# EAGLE design main_board (EAGLE 9.6.2)
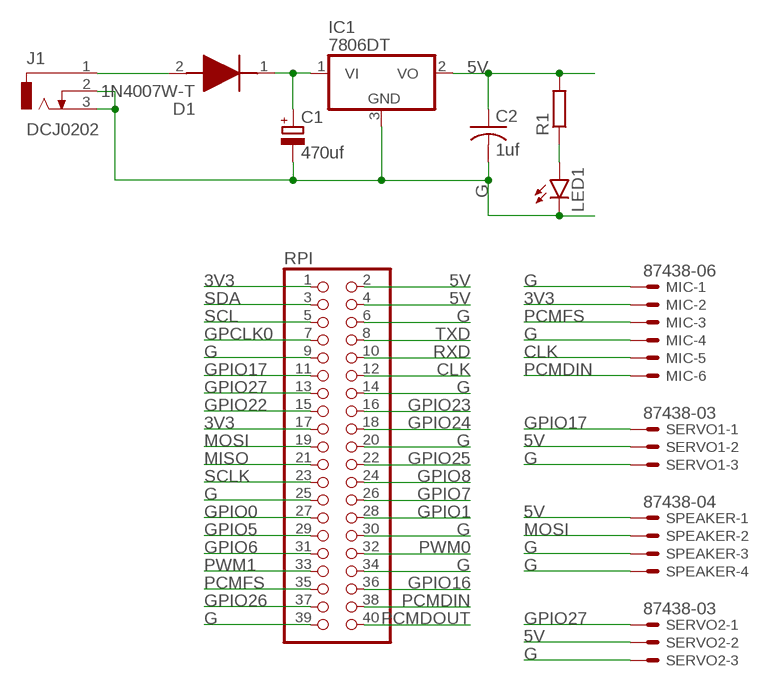
[diagram p0: schematic, sheet 1]

## Parts
C1  470uf  CPOL-EUD  [PANASONIC_D]
C2  1uf  C-USC0805  [C0805]
D1  1N4007W-T  [SODFL3818X130N]
IC1  7806DT  [TO252]
J1  DCJ0202  [DCJ0202]
LED1  LEDCHIP-LED0805  [CHIP-LED0805]
MIC  87438-06  [87438-06]
R1  R-EU_R0603  [R0603]
RPI  PINHD-2X20  [2X20]
SERVO1  87438-03  [87438-03]
SERVO2  87438-03  [87438-03]
SPEAKER  87438-04  [87438-04]

## Nets
3V3: MIC.2 RPI.1 RPI.17
5V: C2.1 IC1.2(VO) R1.2 RPI.2 RPI.4 SERVO1.2 SERVO2.2 SPEAKER.1
CLK: MIC.5 RPI.12
G: C1.- C2.2 IC1.3(GND) J1.2 J1.3 LED1.C MIC.1 MIC.4 RPI.6 RPI.9 RPI.14 RPI.20 RPI.25 RPI.30 RPI.34 RPI.39 SERVO1.3 SERVO2.3 SPEAKER.3 SPEAKER.4
GPCLK0: RPI.7
GPIO0: RPI.27
GPIO1: RPI.28
GPIO5: RPI.29
GPIO6: RPI.31
GPIO7: RPI.26
GPIO8: RPI.24
GPIO16: RPI.36
GPIO17: RPI.11 SERVO1.1
GPIO22: RPI.15
GPIO23: RPI.16
GPIO24: RPI.18
GPIO25: RPI.22
GPIO26: RPI.37
GPIO27: RPI.13 SERVO2.1
MISO: RPI.21
MOSI: RPI.19 SPEAKER.2
N$1: C1.+ D1.1(K) IC1.1(VI)
N$3: LED1.A R1.1
N$4: D1.2(A) J1.1
PCMDIN: MIC.6 RPI.38
PCMDOUT: RPI.40
PCMFS: MIC.3 RPI.35
PWM0: RPI.32
PWM1: RPI.33
RXD: RPI.10
SCL: RPI.5
SCLK: RPI.23
SDA: RPI.3
TXD: RPI.8

## Library data of the parts
C1 = rcl:CPOL-EU: POLARIZED CAPACITOR, European symbol; SPICEPREFIX: C
C2 = rcl:C-US: CAPACITOR, American symbol; SPICEPREFIX: C
D1 = 1N4007W-T:1N4007W-T: Rectifiers SOD-123,1A,1000V,GP Source: Datasheet <https://www.mouser.cn/datasheet/2/345/1n4001w_1n4007w-2449105.pdf>; ARROW_PART_NUMBER: 1N4007W-T; ARROW_PRICE-STOCK: null?region=nac; DESCRIPTION: Rectifiers SOD-123,1A,1000V,GP; HEIGHT: 1.3mm; MANUFACTURER_NAME: Rectron; MANUFACTURER_PART_NUMBER: 1N4007W-T; MOUSER_PART_NUMBER: 583-1N4007W-T; MOUSER_PRICE-STOCK: https://www.mouser.co.uk/ProductDetail/Rectron/1N4007W-T?qs=QNEnbhJQKvah3J4JbJr%2FPw%3D%3D
IC1 = linear:78*: Positive VOLTAGE REGULATOR Source: http://cache.national.com/ds/LM/LM78L05.pdf http://www.fairchildsemi.com/ds/LM/LM7805.pdf
J1 = con-jack:DCJ0202: DC POWER JACK Source: DCJ0202.pdf; OC_FARNELL: unknown; OC_NEWARK: unknown
LED1 = led:LED: LED OSRAM: - CHIPLED LG R971, LG N971, LY N971, LG Q971, LY Q971, LO R971, LY R971 LH N974, LH R974 LS Q976, LO Q976, LY Q976 LO Q996 - Hyper CHIPLED LW Q18S LB Q993, LB Q99A, LB R99A - SideLED LS A670, LO A670, LY A670, LG A670, LP A670 LB A673, LV A673, LT A673, LW A673 LH A674 LY A675 LS A676, LA A676, LO A676, LY A676, LW A676 LS A679, LY A679, LG A679 - Hyper Micro SIDELED® LS Y876, LA Y876, LO Y876, LY Y876 LT Y87S - SmartLED LW L88C, LW L88S LB L89C, LB L89S, LG L890 LS L89K, LO L89K, LY L89K LS L896, LA L896, LO L896, LY L896 - TOPLED LS T670, LO T670, LY T670, LG T670, LP T670 LSG T670, LSP T670, LSY T670, LOP T670, LYG T670 LG T671, LOG T671, LSG T671 LB T673, LV T673, LT T673, LW T673 LH T674 LS T676, LA T676, LO T676, LY T676, LB T676, LH T676, LSB T676, LW T676 LB T67C, LV T67C, LT T67C, LS T67K, LO T67K, LY T67K, LW E67C LS E67B, LA E67B, LO E67B, LY E67B, LB E67C, LV E67C, LT E67C LW T67C LS T679, LY T679, LG T679 LS T770, LO T770, LY T770, LG T770, LP T770 LB T773, LV T773, LT T773, LW T773 LH T774 LS E675, LA E675, LY E675, LS T675 LS T776, LA T776, LO T776, LY T776, LB T776 LHGB T686 LT T68C, LB T68C - Hyper Mini TOPLED® LB M676 - Mini TOPLED Santana® LG M470 LS M47K, LO M47K, LY M47K Source: http://www.osram.convergy.de LUXEON: - LUMILED® LXK2-PW12-R00, LXK2-PW12-S00, LXK2-PW14-U00, LXK2-PW14-V00 LXK2-PM12-R00, LXK2-PM12-S00, LXK2-PM14-U00 LXK2-PE12-Q00, LXK2-PE12-R00, LXK2-PE12-S00, LXK2-PE14-T00, LXK2-PE14-U00 LXK2-PB12-K00, LXK2-PB12-L00, LXK2-PB12-M00, LXK2-PB14-N00, LXK2-PB14-P00, LXK2-PB14-Q00 LXK2-PR12-L00, LXK2-PR12-M00, LXK2-PR14-Q00, LXK2-PR14-R00 LXK2-PD12-Q00, LXK2-PD12-R00, LXK2-PD12-S00 LXK2-PH12-R00, LXK2-PH12-S00 LXK2-PL12-P00, LXK2-PL12-Q00, LXK2-PL12-R00 Source: www.luxeon.com KINGBRIGHT: KA-3528ASYC Source: www.kingbright.com
MIC = con-molex:87438-06: Wire-to-Board 1.50mm (.059") Pitch Header - Right Angle, SMT, Shrouded Source: http://www.molex.com/product/micro/87438.html; MF: MOLEX; MPN: 87438-0643; OC_FARNELL: 1756938; OC_NEWARK: 88K3155
R1 = rcl:R-EU_: RESISTOR, European symbol; SPICEPREFIX: R
RPI = pinhead:PINHD-2X20: PIN HEADER
SERVO1 SERVO2 = con-molex:87438-03: Wire-to-Board 1.50mm (.059") Pitch Header - Right Angle, SMT, Shrouded Source: http://www.molex.com/product/micro/87438.html; MF: MOLEX; OC_FARNELL: 1711328; OC_NEWARK: unknown
SPEAKER = con-molex:87438-04: Wire-to-Board 1.50mm (.059") Pitch Header - Right Angle, SMT, Shrouded Source: http://www.molex.com/product/micro/87438.html; MF: MOLEX; OC_FARNELL: unknown; OC_NEWARK: unknown

## Board
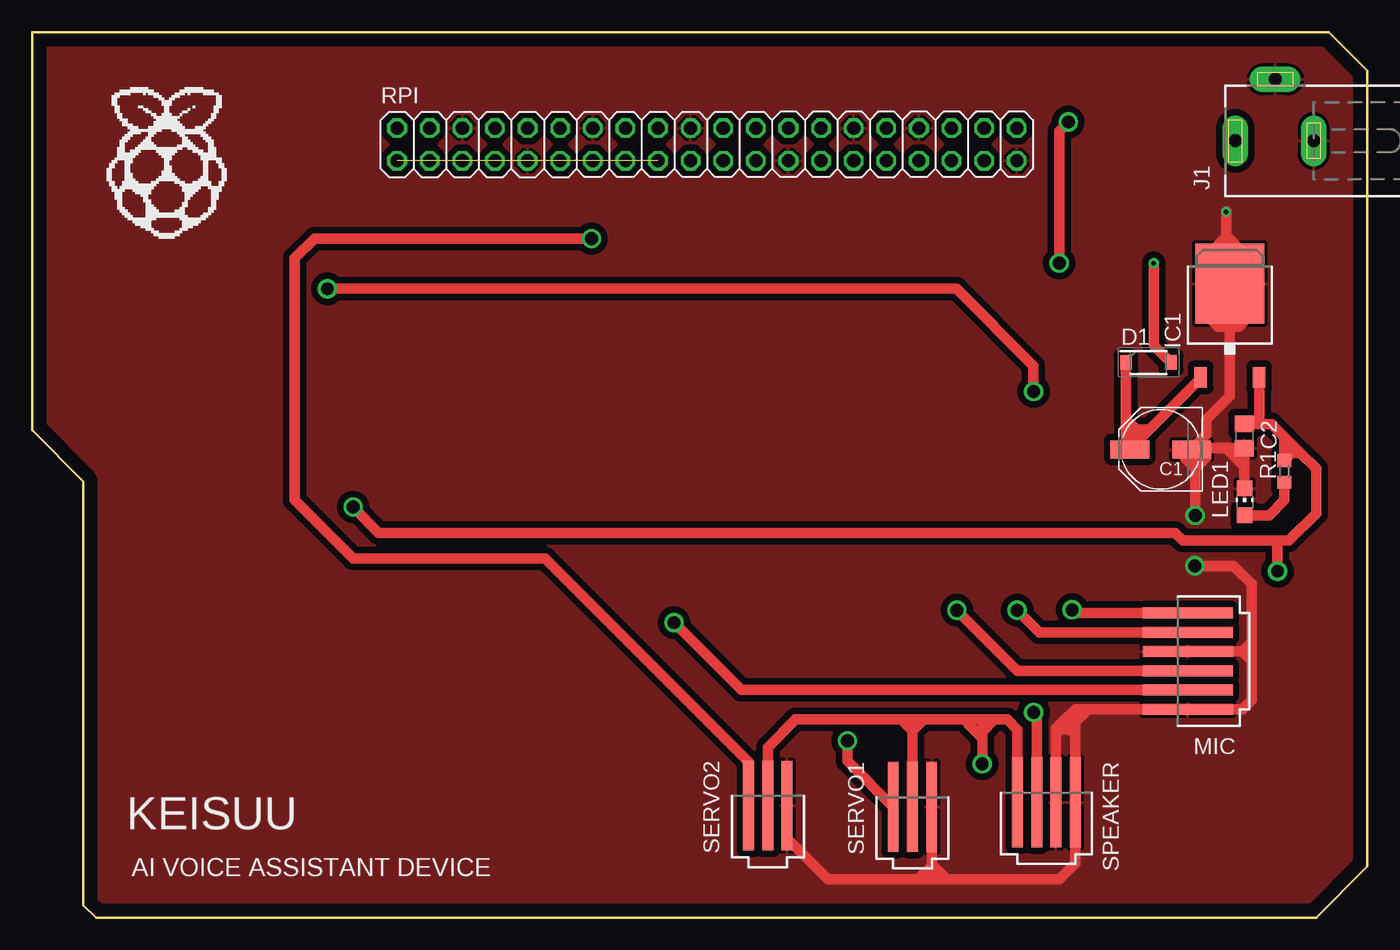
[diagram p1: board, top side]
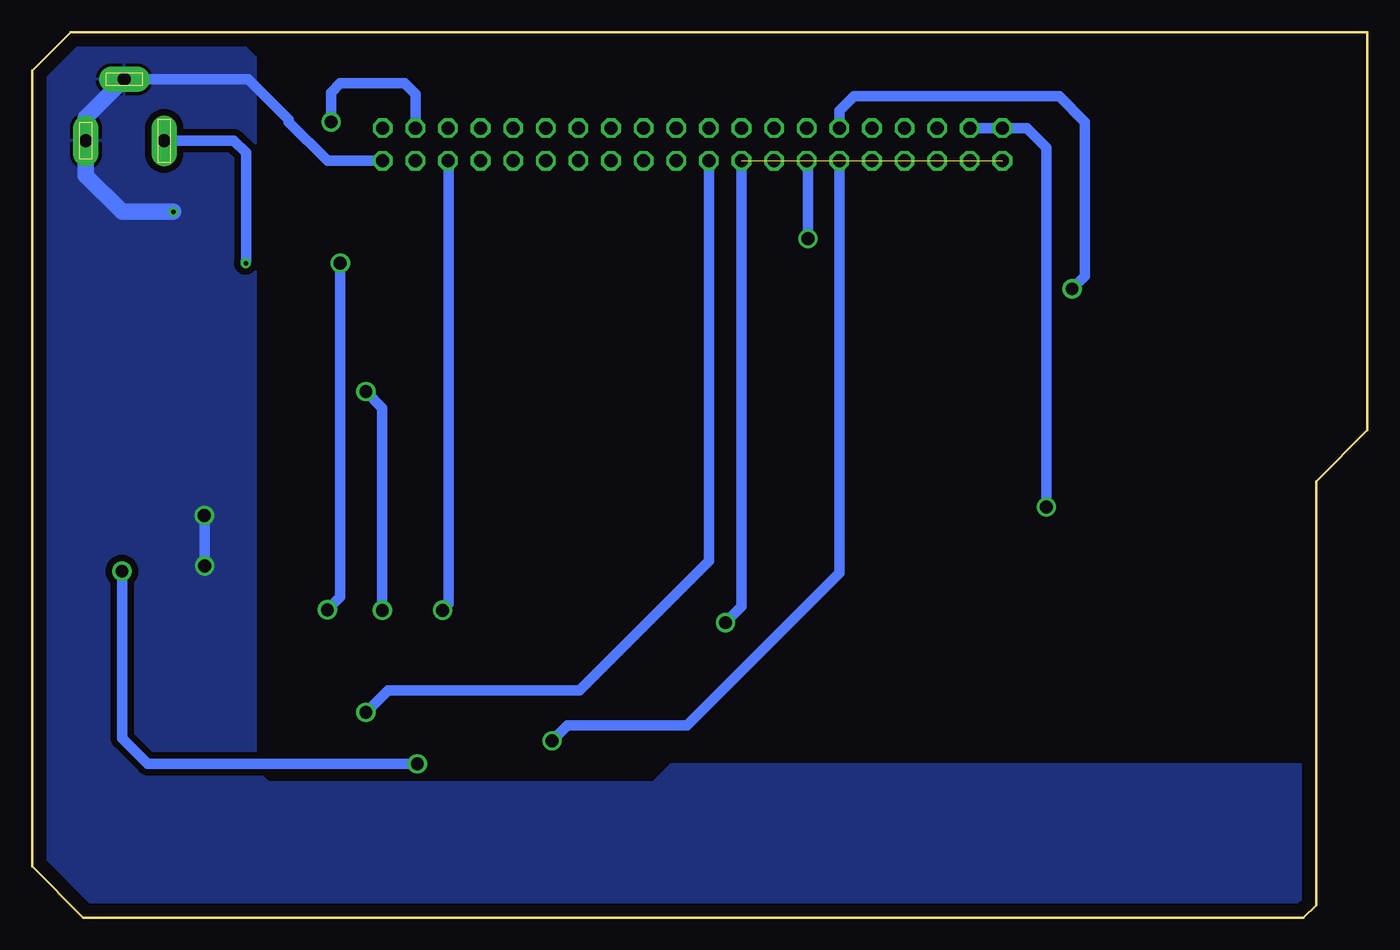
[diagram p2: board, bottom side, seen from below]

Size 104 x 69 mm. Coordinates in mm from the lower left corner, seen from the top.
Outline: 0,69 101,69 104,66 104,4 100,0 5,0 4,1 4,34 0,38 0,69
Copper layers (1*16): Top 0.035mm / dielectric 1.5mm / Bottom 0.035mm
Design rules "default *": minimum track width 6mil, minimum drill 0.35mm, track to track 6mil, track to pad 6mil, pad to pad 6mil, via to via 2.5mm, smd to smd 6mil, copper to edge 40mil, drill to drill 6mil, minimum pad ring 10mil, minimum via ring 8mil, stop-mask expansion 4mil, vias tented up to drill 0mil, thermal gap 10mil

### Footprints (pad centres in the part's own frame; a part is rotated, then mirrored left to right if it is on the bottom)
PANASONIC_D = smd 3 x 1.4: + 2.4,0; - -2.4,0
C0805 = smd 1.3 x 1.5: 1 -0.95,0; 2 0.95,0
SODFL3818X130N = smd 0.92 x 1.13: 1 -1.75,0; 2 1.75,0
TO252 = smd 1 x 1.6: 1 -2.28,-4.8; 2 2.28,-4.8 | smd 5.4 x 6.2: 3 0,2.5
DCJ0202 = drill 1 pad 2 long: 1 0,3.1; 2 4.8,0; 3 0,-3
CHIP-LED0805 = smd 1.2 x 1.2: A 0,-1.05; C 0,1.05
87438-06 = smd 7 x 0.85: 1 0,3.75; 2 0,2.25; 3 0,0.75; 4 0,-0.75; 5 0,-2.25; 6 0,-3.75
R0603 = smd 1 x 1.1: 1 -0.85,0; 2 0.85,0
2X20 = drill 1.016 octagon: 1 -24.13,-1.27; 2 -24.13,1.27; 3 -21.59,-1.27; 4 -21.59,1.27; 5 -19.05,-1.27; 6 -19.05,1.27; 7 -16.51,-1.27; 8 -16.51,1.27; 9 -13.97,-1.27; 10 -13.97,1.27; 11 -11.43,-1.27; 12 -11.43,1.27; 13 -8.89,-1.27; 14 -8.89,1.27; 15 -6.35,-1.27; 16 -6.35,1.27; 17 -3.81,-1.27; 18 -3.81,1.27; 19 -1.27,-1.27; 20 -1.27,1.27; 21 1.27,-1.27; 22 1.27,1.27; 23 3.81,-1.27; 24 3.81,1.27; 25 6.35,-1.27; 26 6.35,1.27; 27 8.89,-1.27; 28 8.89,1.27; 29 11.43,-1.27; 30 11.43,1.27; 31 13.97,-1.27; 32 13.97,1.27; 33 16.51,-1.27; 34 16.51,1.27; 35 19.05,-1.27; 36 19.05,1.27; 37 21.59,-1.27; 38 21.59,1.27; 39 24.13,-1.27; 40 24.13,1.27
87438-03 = smd 7 x 0.85: 1 0,1.5; 2 0,0; 3 0,-1.5
87438-04 = smd 7 x 0.85: 1 0,2.25; 2 0,0.75; 3 0,-0.75; 4 0,-2.25

### Placement (x,y rotation side)
C1  87.9,36.5 180 top
C2  94.42,37.53 270 top
D1  86.95,43.26 0 top
IC1  93.28,46.91 0 top
J1  96.82,60.53 90 top
LED1  94.44,32.41 0 top
MIC  90,20 180 top
R1  97.54,34.79 90 top
RPI  52.56,60.25 0 top
SERVO1  68.56,8.66 90 top
SERVO2  57.3,8.75 90 top
SPEAKER  79,9 90 top

### Tracks (layer width: path | path; a pad name or v marks a point on that pad's centre or on a via)
3V3  (via drill 1)  (1 unrouted)
  Top 0.813: MIC.2 55.25,17.75 v50,23
  Bottom 0.813: v50,23 48.75,24.25 RPI.17
5V  (via drill 1)
  Top 0.813: 94.56,38.63 C2.1 95.79,38.48 | IC1.2 95.56,38.71 95.79,38.48 | 97.54,37.46 R1.2 98.13,36.23 98.77,36.23 | 95.79,38.48 96.52,38.48 97.54,37.46 | 98.77,36.23 100,35 100,31.5 97.88,29.38 97,29.38 | 98.77,36.23 97.54,37.46 | v25,32 27,30 89,30 89.62,29.38 97,29.38 | SPEAKER.1 76.75,14.66 75.96,15.45 74.95,15.45 | 69.45,15.45 72.91,15.45 | 72.91,15.45 74,15.45 | 74,15.45 74.95,15.45 | SERVO1.2 68.56,14.56 | 68.56,14.56 69.45,15.45 | SERVO2.2 57.3,13.3 59.45,15.45 67.96,15.45 | 67.96,15.45 69.45,15.45 | 67.96,15.45 67.96,15.17 68.56,14.56 | 74,15.45 74,14.51 | 74,14 v74,12 | v97,27 97,29.38 | 74,14.51 74,14 | 74,14.51 74.95,15.45 | 74,14 72.91,15.09 72.91,15.45
  Bottom 0.813: RPI.4 RPI.2 26.52,61.52 25,60 v25,32 | v74,12 95,12 97,14 v97,27
CLK  (via drill 1)
  Top 0.813: v78,41 78,43 72,49 v23,49 | MIC.5 78.43,22.25 v76.72,23.96
  Bottom 0.813: v23,49 22,50 22,62 24,64 40,64 41.13,62.87 RPI.12 | v76.72,23.96 76.72,39.72 v78,41
G  (via drill 0.35, 1)
  Top 0.813: 94.42,35.14 C2.2 92.98,36.58 | 94.42,35.14 94.42,33.47 LED1.C | 92.98,36.58 91.46,36.58 | 91.46,36.58 90.38,36.58 | 90.38,36.58 C1.- 91.46,37.66 91.46,38.82 93.28,40.65 93.28,46.06 | 93,53 v93,55 93,53.06 92.22,52.28 | 93,53 93,49.13 | 93,53 93.15,53 94,52.15 | 92.98,36.58 94.42,35.14 | v90.59,31.35 90.59,35 | 90.59,35 89.81,35.78 89.81,36.03 90.36,36.58 90.38,36.58 | 90.59,35 90.59,36.38 90.38,36.58 | 90.59,35 91.46,35.87 91.46,36.58 | MIC.4 94.25,20.75 | 94.25,20.75 95,20 | 95,20 95,17 94.25,16.25 MIC.1 82.25,16.25 | 95,20 95,21.5 | 95,21.5 95,26 93.58,27.42 v90.57,27.42 | 94.25,20.75 95,21.5 | IC1.3 93.28,46.06 | 93.28,46.06 94,46.06 94.38,46.44 | 93.28,46.06 92.34,46.06 91.96,46.44 | SERVO1.3 70.06,4.06 | 69,3 70.06,4.06 | 69,3 62,3 58.8,6.2 SERVO2.3 | 71.26,3 80,3 81.25,4.25 SPEAKER.4 81.25,14.25 | 71.26,3 70.12,3 | 70.12,3 69,3 | 70.06,4.06 70.2,4.06 71.26,3 | 70.06,4.06 70.06,3.05 70.12,3 | 81.25,14.25 81.25,15.25 | 82.25,16.25 81.25,15.25 | SPEAKER.3 79.75,14.31 | 79.75,14.31 79.75,14.75 80.25,15.25 | 82.25,16.25 81.25,16.25 80.25,15.25 | 81.25,15.25 80.25,15.25 | 81.25,14.25 80.8,14.7 | 80.8,14.7 80.25,15.25 | 80.8,14.7 80.14,14.7 79.75,14.31
  Top 1.27: IC1.3 93,49.13 93,50.13 93.13,50 94,50 94.25,50.25
  Bottom 0.813: RPI.39 76.71,59 81,59 84,62 84,62.17 87.16,65.33 J1.2 | v90.57,27.42 90.57,31.33 v90.59,31.35
  Bottom 1.27: J1.2 99.82,62.33 J1.3 99.82,57.82 97,55 v93,55
  pour Bottom (isolate 0.508): 4.08,11.97 54.27,11.97 55.69,10.55 85.56,10.55 86.58,11.56 86.58,67.04 88.41,68.87 100.8,68.87 103.85,65.82 103.85,4.05 99.99,0.19 5.1,0.19 4.08,1.2
  pour Top (isolate 0.508): 0.22,38.18 4.28,34.12 4.28,0.19 99.99,0.19 103.85,4.05 103.85,66.02 101.01,68.87 0.42,68.87 0.22,68.66
GPIO17  (via drill 1)
  Top 0.813: SERVO1.1 63.5,12.22 v63.5,13.79
  Bottom 0.813: v63.5,13.79 62.29,15 53,15 41.13,26.87 RPI.11
GPIO27  (via drill 1)
  Top 0.813: SERVO2.1 55.8,12.17 39.97,28 25,28 20.46,32.54 20.46,51.39 21.99,52.92 v43.58,52.92
  Bottom 0.813: RPI.13 43.58,58.89 v43.58,52.92
MOSI  (via drill 1)
  Top 0.813: SPEAKER.2 78.25,15.75 v78,16
  Bottom 0.813: v78,16 76.26,17.74 61.36,17.74 51.29,27.8 RPI.19
N$1
  Top 0.813: IC1.1 91,42.01 87.03,38.03 | 87.03,38.03 86.53,37.53 | 86.53,37.53 86.42,37.42 | 86.42,37.42 C1.+ | 84.6,36.79 84.89,36.5 C1.+ | D1.1 85.2,39.33 85.2,38.85 | 85.2,38.85 85.2,38.21 | 85.2,38.21 85.2,37.42 | 85.2,37.42 85.2,36.8 C1.+ | 86.42,37.42 86,37.42 | 86,37.42 85.2,37.42 | 86,37.42 85.38,38.03 | 87.03,38.03 85.38,38.03 | 85.38,38.03 85.2,38.21 | 86.53,37.53 85.2,38.85
N$3
  Top 0.813: R1.1 97.54,32.54 96.36,31.36 LED1.A
N$4  (via drill 0.35)
  Top 0.813: D1.2 87.36,44.6 v87.36,51
  Bottom 0.813: J1.1 88.29,60.53 87.35,59.59 87.35,51.14 87.36,51.12 v87.36,51
PCMDIN  (via drill 1)
  Top 0.813: v80,51 80,61.3 v80.7,62 | MIC.6 81.25,23.75 v81,24
  Bottom 0.813: v80.7,62 80.7,64.3 80,65 75,65 74.15,64.15 RPI.38 | v81,24 80,25 v80,51
PCMFS  (via drill 1)
  Top 0.813: MIC.3 76.73,19.25 v72.03,23.96
  Bottom 0.813: v72.03,23.96 71.55,24.44 71.55,58.98 RPI.35

### Text on the board
tPlace: KEISUU | AI VOICE ASSISTANT DEVICE